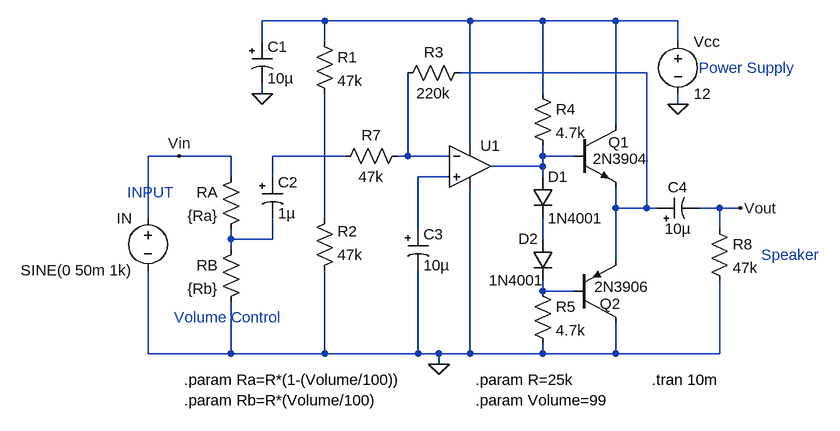
[diagram p0: schematic Final Project.asc]
Final Project.asc, the LTspice schematic file:
Version 4
SHEET 1 880 680
WIRE 48 -96 -48 -96
WIRE 272 -96 48 -96
WIRE 384 -96 272 -96
WIRE 496 -96 384 -96
WIRE 592 -96 496 -96
WIRE -48 -64 -48 -96
WIRE 48 -64 48 -96
WIRE 592 -64 592 -96
WIRE 544 -16 256 -16
WIRE -48 16 -48 0
WIRE 384 16 384 -96
WIRE 592 32 592 16
WIRE 496 64 496 -96
WIRE 272 96 272 -96
WIRE -176 112 -224 112
WIRE -96 112 -176 112
WIRE 80 112 -32 112
WIRE 176 112 176 -16
WIRE 176 112 160 112
WIRE 240 112 176 112
WIRE 384 112 384 96
WIRE 432 112 384 112
WIRE 384 128 384 112
WIRE 384 128 304 128
WIRE -96 144 -96 112
WIRE -32 144 -32 112
WIRE 240 144 192 144
WIRE 384 144 384 128
WIRE 496 192 496 160
WIRE 544 192 544 -16
WIRE 544 192 496 192
WIRE 560 192 544 192
WIRE 656 192 624 192
WIRE 688 192 656 192
WIRE -224 208 -224 112
WIRE 48 208 48 16
WIRE 192 224 192 144
WIRE 656 224 656 192
WIRE -96 240 -96 224
WIRE -32 240 -32 208
WIRE -32 240 -96 240
WIRE 384 240 384 208
WIRE -96 256 -96 240
WIRE 496 272 496 192
WIRE 384 320 384 304
WIRE 432 320 384 320
WIRE -224 416 -224 288
WIRE -96 416 -96 336
WIRE -96 416 -224 416
WIRE 48 416 48 288
WIRE 48 416 -96 416
WIRE 192 416 192 288
WIRE 192 416 48 416
WIRE 224 416 192 416
WIRE 272 416 272 160
WIRE 272 416 224 416
WIRE 384 416 384 400
WIRE 384 416 272 416
WIRE 496 416 496 368
WIRE 496 416 384 416
WIRE 656 416 656 304
WIRE 656 416 496 416
WIRE 224 432 224 416
FLAG -48 16 0
FLAG 224 432 0
FLAG 592 32 0
FLAG -176 112 Vin
FLAG 688 192 Vout
SYMBOL res 32 -80 R0
SYMATTR InstName R1
SYMATTR Value 47k
SYMBOL res 176 96 R90
WINDOW 0 0 56 VBottom 2
WINDOW 3 32 56 VTop 2
SYMATTR InstName R7
SYMATTR Value 47k
SYMBOL res 32 304 M180
WINDOW 0 36 76 Left 2
WINDOW 3 36 40 Left 2
SYMATTR InstName R2
SYMATTR Value 47k
SYMBOL Opamps\\UniversalOpamp2 272 128 R0
SYMATTR InstName U1
SYMBOL res 160 0 R270
WINDOW 0 32 56 VTop 2
WINDOW 3 0 56 VBottom 2
SYMATTR InstName R3
SYMATTR Value 220k
SYMBOL diode 368 144 R0
SYMATTR InstName D1
SYMATTR Value 1N4001
SYMBOL diode 368 240 R0
WINDOW 0 -22 -1 Left 2
WINDOW 3 -67 63 Left 2
SYMATTR InstName D2
SYMATTR Value 1N4001
SYMBOL res 368 304 R0
SYMATTR InstName R5
SYMATTR Value 4.7k
SYMBOL res 368 0 R0
SYMATTR InstName R4
SYMATTR Value 4.7k
SYMBOL npn 432 64 R0
WINDOW 0 53 27 Left 2
WINDOW 3 29 52 Left 2
SYMATTR InstName Q1
SYMATTR Value 2N3904
SYMBOL pnp 432 368 M180
WINDOW 0 40 29 Left 2
WINDOW 3 31 55 Left 2
SYMATTR InstName Q2
SYMATTR Value 2N3906
SYMBOL res 640 208 R0
SYMATTR InstName R8
SYMATTR Value 47k
SYMBOL voltage 592 -80 R0
WINDOW 123 0 0 Left 2
WINDOW 39 0 0 Left 2
SYMATTR InstName Vcc
SYMATTR Value 12
SYMBOL res -80 128 M0
SYMATTR InstName RA
SYMATTR Value {Ra}
SYMBOL res -80 240 M0
SYMATTR InstName RB
SYMATTR Value {Rb}
SYMBOL polcap -64 -64 R0
SYMATTR InstName C1
SYMATTR Value 10µ
SYMATTR SpiceLine V=25
SYMBOL polcap -48 144 R0
SYMATTR InstName C2
SYMATTR Value 1µ
SYMATTR SpiceLine V=10
SYMBOL polcap 176 224 R0
SYMATTR InstName C3
SYMATTR Value 10µ
SYMATTR SpiceLine V=10
SYMBOL polcap 560 208 R270
WINDOW 0 32 32 VTop 2
WINDOW 3 0 32 VBottom 2
SYMATTR InstName C4
SYMATTR Value 10µ
SYMATTR SpiceLine V=10
SYMBOL voltage -224 192 M0
WINDOW 123 24 124 Left 2
WINDOW 39 24 124 Left 2
SYMATTR InstName IN
SYMATTR Value SINE(0 50m 1k)
TEXT -184 360 Left 2 ;Volume Control
TEXT 720 264 Left 2 ;Speaker
TEXT 624 -24 Left 2 ;Power Supply
TEXT -168 488 Left 2 !.param Rb=R*(Volume/100)
TEXT -168 456 Left 2 !.param Ra=R*(1-(Volume/100))
TEXT 552 456 Left 2 !.tran 10m
TEXT 280 456 Left 2 !.param R=25k
TEXT 280 488 Left 2 !.param Volume=99
TEXT -256 168 Left 2 ;INPUT

The netlist it stands for:
* Final Project.asc
R1 N001 N007 47k
R7 N004 N003 47k
R2 0 N007 47k
XU1 N006 N004 N001 0 N005 level.2 Avol=1Meg GBW=10Meg Slew=10Meg ilimit=25m rail=0 Vos=0 phimargin=45 en=0 enk=0 in=0 ink=0 Rin=500Meg  ; pins IN+ IN- V+ V- OUT
R3 N004 N002 220k
D1 N005 N009 1N4001
D2 N009 N010 1N4001
R5 N010 0 4.7k
R4 N001 N005 4.7k
Q1 N001 N005 N002 0 2N3904
Q2 0 N010 N002 0 2N3906
R8 Vout 0 47k
Vcc N001 0 12
RA Vin N008 {Ra}
RB N008 0 {Rb}
C1 N001 0 10µ V=25
C2 N003 N008 1µ V=10
C3 N006 0 10µ V=10
C4 N002 Vout 10µ V=10
V§IN Vin 0 SINE(0 50m 1k)
.model D D
.lib standard.dio
.model NPN NPN
.model PNP PNP
.lib standard.bjt
* Volume Control
* Speaker
* Power Supply
.param Rb=R*(Volume/100)
.param Ra=R*(1-(Volume/100))
.tran 10m
.param R=25k
.param Volume=99
* INPUT
.lib UniversalOpamps2.sub
.backanno
.end